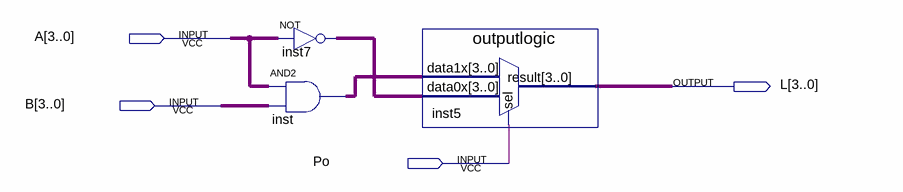
[diagram p0: schematic sheet]
// Quartus schematic LogicUnit.bdf as structural Verilog: 3 symbols, 4 pins
module LogicUnit (
  input  [3:0] A,
  input  [3:0] B,
  input  Po,
  output [3:0] L
);

  wire [3:0] inst7_out, inst_out;

  assign inst7_out = ~A;  // NOT inst7, 4 bits wide
  assign inst_out = A & B;  // AND2 inst, 4 bits wide
  outputlogic inst5 (.data1x(inst_out), .data0x(inst7_out), .sel(Po), .result(L));
endmodule
